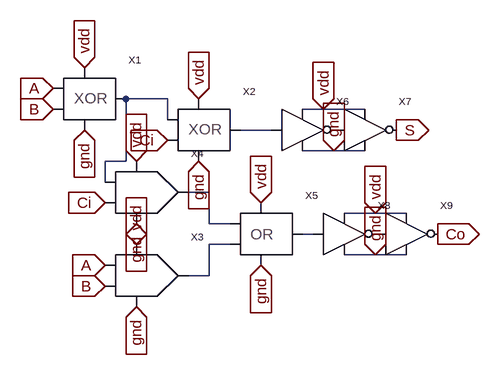
[diagram p0: schematic fa.asc]
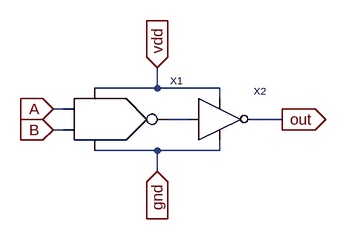
[diagram p1: sub-circuit and.asc]
fa.asc, the LTspice schematic file:
Version 4.1
SHEET 1 952 680
WIRE 432 16 368 16
WIRE 672 32 640 32
WIRE 736 32 672 32
WIRE 432 48 432 16
WIRE 592 64 544 64
WIRE 688 96 640 96
WIRE 736 96 688 96
WIRE 368 112 368 16
WIRE 368 112 336 112
WIRE 336 144 336 112
WIRE 496 160 464 160
WIRE 752 192 704 192
WIRE 800 192 752 192
WIRE 496 208 496 160
WIRE 528 208 496 208
WIRE 656 224 640 224
WIRE 528 240 496 240
WIRE 752 256 704 256
WIRE 800 256 752 256
WIRE 496 288 496 240
WIRE 496 288 464 288
FLAG 256 0 A
IOPIN 256 0 In
FLAG 256 32 B
IOPIN 256 32 In
FLAG 336 272 A
IOPIN 336 272 In
FLAG 336 304 B
IOPIN 336 304 In
FLAG 336 176 Ci
IOPIN 336 176 In
FLAG 432 80 Ci
IOPIN 432 80 In
FLAG 304 -32 vdd
IOPIN 304 -32 In
FLAG 480 16 vdd
IOPIN 480 16 In
FLAG 384 112 vdd
IOPIN 384 112 In
FLAG 576 176 vdd
IOPIN 576 176 In
FLAG 384 240 vdd
IOPIN 384 240 In
FLAG 304 64 gnd
IOPIN 304 64 In
FLAG 480 112 gnd
IOPIN 480 112 In
FLAG 384 336 gnd
IOPIN 384 336 In
FLAG 576 272 gnd
IOPIN 576 272 In
FLAG 384 208 gnd
IOPIN 384 208 In
FLAG 672 32 vdd
IOPIN 672 32 In
FLAG 752 192 vdd
IOPIN 752 192 In
FLAG 784 64 S
IOPIN 784 64 Out
FLAG 848 224 Co
IOPIN 848 224 Out
FLAG 688 96 gnd
IOPIN 688 96 In
FLAG 752 256 gnd
IOPIN 752 256 In
SYMBOL xor 304 16 R0
SYMATTR InstName X1
SYMBOL xor 480 64 R0
SYMATTR InstName X2
SYMBOL and 384 288 R0
SYMATTR InstName X3
SYMBOL and 384 160 R0
SYMATTR InstName X4
SYMBOL or 576 224 R0
SYMATTR InstName X5
SYMBOL inv 640 64 R0
SYMATTR InstName X6
SYMBOL inv 736 64 R0
SYMATTR InstName X7
SYMBOL inv 704 224 R0
SYMATTR InstName X8
SYMBOL inv 800 224 R0
SYMATTR InstName X9

and.asc, the sub-circuit schematic file:
Version 4.1
SHEET 1 880 680
WIRE 304 112 304 80
WIRE 304 112 208 112
WIRE 400 112 304 112
WIRE 400 128 400 112
WIRE 160 144 144 144
WIRE 352 160 320 160
WIRE 496 160 448 160
WIRE 160 176 144 176
WIRE 304 208 208 208
WIRE 400 208 400 192
WIRE 400 208 304 208
WIRE 304 240 304 208
FLAG 144 144 A
IOPIN 144 144 In
FLAG 144 176 B
IOPIN 144 176 In
FLAG 304 80 vdd
IOPIN 304 80 In
FLAG 304 240 gnd
IOPIN 304 240 In
FLAG 496 160 out
IOPIN 496 160 Out
SYMBOL nand 208 160 R0
SYMATTR InstName X1
SYMBOL inv 400 160 R0
SYMATTR InstName X2

The netlist it stands for:
* fa.asc
X§X1 A B gnd vdd N001 xor  ; pins A B gnd vdd out
X§X2 N001 Ci gnd vdd N002 xor  ; pins A B gnd vdd out
X§X3 vdd A B gnd N005 and
X§X4 vdd N001 Ci gnd N003 and
X§X5 N003 N005 vdd gnd N004 or  ; pins A B vdd gnd out
X§X6 P001 N002 vdd gnd inv  ; pins out in vdd gnd
X§X7 S P001 vdd gnd inv  ; pins out in vdd gnd
X§X8 P002 N004 vdd gnd inv  ; pins out in vdd gnd
X§X9 Co P002 vdd gnd inv  ; pins out in vdd gnd

* block symbol definitions
.subckt and vdd A B gnd out
X§X1 A B N001 vdd gnd nand  ; pins A B out vdd gnd
X§X2 out N001 vdd gnd inv  ; pins out in vdd gnd
.ends and

.backanno
.end